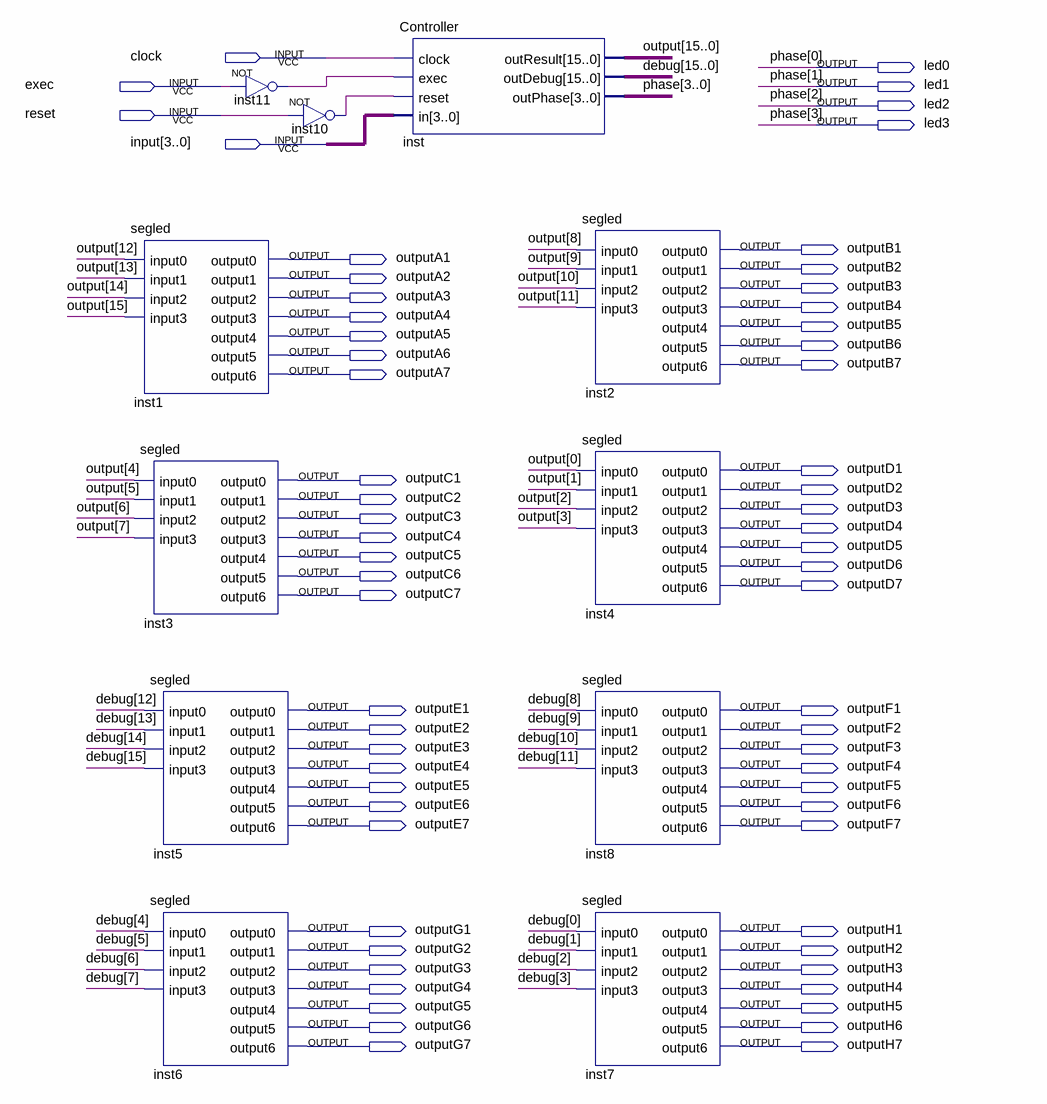
[diagram p0: schematic sheet]
// Quartus schematic simple-architecture.bdf as structural Verilog: 11 symbols, 64 pins
module \simple-architecture  (
  input  clock,
  input  exec,
  input  reset,
  input  [3:0] \input ,
  output led0,
  output led1,
  output led2,
  output led3,
  output outputB1,
  output outputA1,
  output outputB2,
  output outputA2,
  output outputB3,
  output outputA3,
  output outputB4,
  output outputA4,
  output outputB5,
  output outputA5,
  output outputB6,
  output outputA6,
  output outputB7,
  output outputA7,
  output outputD1,
  output outputC1,
  output outputD2,
  output outputC2,
  output outputD3,
  output outputC3,
  output outputD4,
  output outputC4,
  output outputD5,
  output outputC5,
  output outputD6,
  output outputC6,
  output outputD7,
  output outputC7,
  output outputE1,
  output outputF1,
  output outputE2,
  output outputF2,
  output outputE3,
  output outputF3,
  output outputE4,
  output outputF4,
  output outputE5,
  output outputF5,
  output outputE6,
  output outputF6,
  output outputE7,
  output outputF7,
  output outputG1,
  output outputH1,
  output outputG2,
  output outputH2,
  output outputG3,
  output outputH3,
  output outputG4,
  output outputH4,
  output outputG5,
  output outputH5,
  output outputG6,
  output outputH6,
  output outputG7,
  output outputH7
);

  wire inst10_out, inst11_out;
  wire [15:0] debug, \output ;

  segled inst1 (
    .input0(\output [12]), .input1(\output [13]), .input2(\output [14]), .input3(\output [15]),
    .output0(outputA1), .output1(outputA2), .output2(outputA3), .output3(outputA4), .output4(outputA5),
    .output5(outputA6), .output6(outputA7));
  segled inst3 (
    .input0(\output [4]), .input1(\output [5]), .input2(\output [6]), .input3(\output [7]),
    .output0(outputC1), .output1(outputC2), .output2(outputC3), .output3(outputC4), .output4(outputC5),
    .output5(outputC6), .output6(outputC7));
  segled inst5 (
    .input0(debug[12]), .input1(debug[13]), .input2(debug[14]), .input3(debug[15]), .output0(outputE1),
    .output1(outputE2), .output2(outputE3), .output3(outputE4), .output4(outputE5), .output5(outputE6),
    .output6(outputE7));
  segled inst6 (
    .input0(debug[4]), .input1(debug[5]), .input2(debug[6]), .input3(debug[7]), .output0(outputG1),
    .output1(outputG2), .output2(outputG3), .output3(outputG4), .output4(outputG5), .output5(outputG6),
    .output6(outputG7));
  not inst11 (inst11_out, exec);
  not inst10 (inst10_out, reset);
  Controller inst (
    .clock(clock), .exec(inst11_out), .reset(inst10_out), .in(\input ), .outResult(\output ),
    .outDebug(debug), .outPhase({led3, led2, led1, led0}));
  segled inst2 (
    .input0(\output [8]), .input1(\output [9]), .input2(\output [10]), .input3(\output [11]),
    .output0(outputB1), .output1(outputB2), .output2(outputB3), .output3(outputB4), .output4(outputB5),
    .output5(outputB6), .output6(outputB7));
  segled inst4 (
    .input0(\output [0]), .input1(\output [1]), .input2(\output [2]), .input3(\output [3]),
    .output0(outputD1), .output1(outputD2), .output2(outputD3), .output3(outputD4), .output4(outputD5),
    .output5(outputD6), .output6(outputD7));
  segled inst8 (
    .input0(debug[8]), .input1(debug[9]), .input2(debug[10]), .input3(debug[11]), .output0(outputF1),
    .output1(outputF2), .output2(outputF3), .output3(outputF4), .output4(outputF5), .output5(outputF6),
    .output6(outputF7));
  segled inst7 (
    .input0(debug[0]), .input1(debug[1]), .input2(debug[2]), .input3(debug[3]), .output0(outputH1),
    .output1(outputH2), .output2(outputH3), .output3(outputH4), .output4(outputH5), .output5(outputH6),
    .output6(outputH7));

  // Other names for the same wires on the sheet: phase[3:0] = {led3, led2, led1, led0}
endmodule
